# Altium project Gimbal_Rev2.PrjPcb (part 1 of 2)
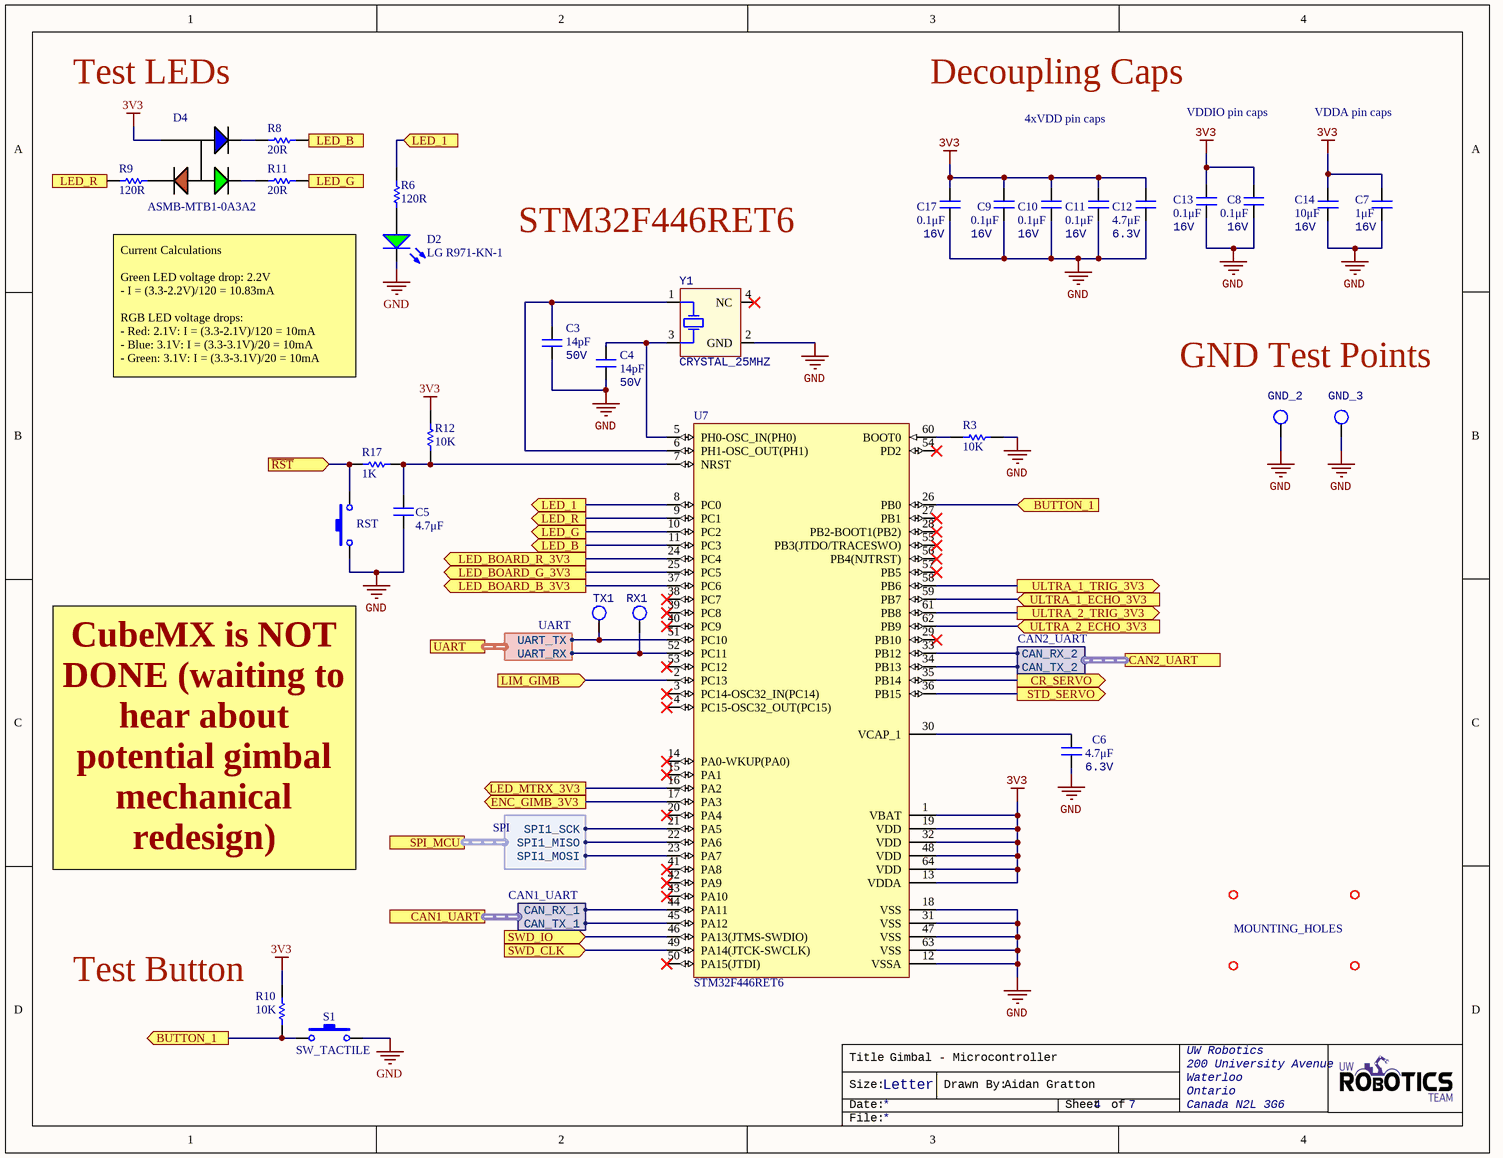
[diagram p0: MCU.SchDoc]
5 sheets, 110 parts. Net scope: flat (ports and power ports of the same name join across sheets).
Sheets:
  MCU.SchDoc
  Sensors.SchDoc
  Connectors.SchDoc
  CAN.SchDoc
  POWER.SchDoc

## Sheet MCU.SchDoc: Gimbal - Microcontroller
size Letter; DrawnBy: Aidan Gratton; Organization: UW Robotics; Address1: 200 University Avenue; Address2: Waterloo; Address3: Ontario; Address4: Canada N2L 3G6; SheetNumber: 4; SheetTotal: 7

### Parts
C3  value 14pF  Voltage Rating (DC): 50V  [CAPC0603(1608)55_N]  (hidden comment: CL10C140JB8NNNC)
C4  value 14pF  Voltage Rating (DC): 50V  [CAPC0603(1608)55_N]  (hidden comment: CL10C140JB8NNNC)
C5  value 4.7μF  [CAPC0603(1608)55_N]  (hidden comment: CAP_4.7uF_0603)
C6  value 4.7μF  Voltage Rating: 6.3V  [CAPC0603(1608)55_N]  (hidden comment: CAP_4.7uF_0603)
C7  value 1μF  Voltage Rating: 16V  [CAPC0603(1608)55_N]  (hidden comment: CAP_1uF_16V_0603)
C8  value 0.1μF  Voltage Rating: 16V  [CAPC0603(1608)55_N]  (hidden comment: CAP_0.1uF_16V_0603)
C9  value 0.1μF  Voltage Rating: 16V  [CAPC0603(1608)55_N]  (hidden comment: CAP_0.1uF_16V_0603)
C10  value 0.1μF  Voltage Rating: 16V  [CAPC0603(1608)55_N]  (hidden comment: CAP_0.1uF_16V_0603)
C11  value 0.1μF  Voltage Rating: 16V  [CAPC0603(1608)55_N]  (hidden comment: CAP_0.1uF_16V_0603)
C12  value 4.7μF  Voltage Rating: 6.3V  [CAPC0603(1608)55_N]  (hidden comment: CAP_4.7uF_0603)
C13  value 0.1μF  Voltage Rating: 16V  [CAPC0603(1608)55_N]  (hidden comment: CAP_0.1uF_16V_0603)
C14  value 10μF  Voltage Rating: 16V  [CAPC0603(1608)55_N]  (hidden comment: CAP_10nF_0603)
C17  value 0.1μF  Voltage Rating: 16V  [CAPC0603(1608)55_N]  (hidden comment: CAP_0.1uF_16V_0603)
D2  LG R971-KN-1  [LED_0805_LINE]
D4  Manufacturer Part Number 1: ASMB-MTB1-0A3A2  [LED_RGB]  (hidden comment: LED_RGB)
GND_2  TESTPOINT_LOOP  [TESTPOINT_LOOP]  (value not drawn)
GND_3  TESTPOINT_LOOP  [TESTPOINT_LOOP]  (value not drawn)
MH1  MOUNTING_HOLES  [MOUNTING_HOLE]
MH2  MOUNTING_HOLES  [MOUNTING_HOLE]  (value not drawn)
MH3  MOUNTING_HOLES  [MOUNTING_HOLE]  (value not drawn)
MH4  MOUNTING_HOLES  [MOUNTING_HOLE]  (value not drawn)
R3  value 10K  [RESC0603(1608)_N]  (hidden comment: RES_10K_0603)
R6  value 120R  [RESC0603(1608)_N]  (hidden comment: RES_120R_0603)
R8  value 20R  [RESC0603(1608)_N]  (hidden comment: RES_20R_0603)
R9  value 120R  [RESC0603(1608)_N]  (hidden comment: RES_120R_0603)
R10  value 10K  [RESC0603(1608)_N]  (hidden comment: RES_10K_0603)
R11  value 20R  [RESC0603(1608)_N]  (hidden comment: RES_20R_0603)
R12  value 10K  [RESC0603(1608)_N]  (hidden comment: RES_10K_0603)
R17  value 1K  [RESC0603(1608)_N]  (hidden comment: RES_1K_0603)
RST  SW_PWR  [PTS830GM140]  (value not drawn)
RX1  TESTPOINT_LOOP  [TESTPOINT_LOOP]  (value not drawn)
S1  SW_TACTILE  [B3U-1000P]
TX1  TESTPOINT_LOOP  [TESTPOINT_LOOP]  (value not drawn)
U7  STM32F446RET6  [STM-LQFP64_L]
Y1  CRYSTAL_25MHZ  [SOIC254P1016X440-4N]

### Ports
BUTTON_1 (in), BUTTON_1 (out), CAN1_UART (harness CAN1_UART), CAN2_UART (harness CAN2_UART), CR_SERVO (out), ENC_GIMB_3V3 (out), LED_1 (in), LED_1 (out), LED_B (in), LED_B (out), LED_BOARD_B_3V3 (out), LED_BOARD_G_3V3 (out), LED_BOARD_R_3V3 (out), LED_G (in), LED_G (out), LED_MTRX_3V3 (out), LED_R (in), LED_R (out), LIM_GIMB (in), SPI_MCU (harness SPI), STD_SERVO (out), SWD_CLK (in), SWD_IO (in), UART (harness UART), ULTRA_1_ECHO_3V3 (in), ULTRA_1_TRIG_3V3 (out), ULTRA_2_ECHO_3V3 (in), ULTRA_2_TRIG_3V3 (out), ~{RST} (in)

### Harnesses
UART: UART_RX, UART_TX
CAN1_UART: CAN_RX_1, CAN_TX_1
CAN2_UART: CAN_RX_2, CAN_TX_2
SPI: SPI1_SCK, SPI1_MISO, SPI1_MOSI

### Nets
3V3: C7.2 C8.2 C9.2 C10.2 C11.2 C12.2 C13.2 C14.2 C17.2 D4.4 R10.1 R12.2 U7.1(VBAT) U7.13(VDDA) U7.19(VDD) U7.32(VDD) U7.48(VDD) U7.64(VDD)
GND: C3.1 C4.1 C5.1 C6.1 C7.1 C8.1 C9.1 C10.1 C11.1 C12.1 C13.1 C14.1 C17.1 D2.2(K) GND_2.1 GND_3.1 R3.2 RST.1 S1.2 U7.12(VSSA) U7.18(VSS) U7.31(VSS) U7.47(VSS) U7.63(VSS) Y1.2(GND)
NetC3_2: C3.2 U7.6(PH1-OSC_OUT(PH1)) Y1.1(HOT)
NetC4_2: C4.2 U7.5(PH0-OSC_IN(PH0)) Y1.3(HOT)
NetC5_2: C5.2 R12.1 R17.2 U7.7(NRST)
NetC6_2: C6.2 U7.30(VCAP_1)
NetCR_SERVO_1: U7.35(PB14) ; port CR_SERVO
NetD2_1: D2.1(A) R6.2
NetD4_1: D4.1 R9.2
NetD4_2: D4.2 R11.1
NetD4_3: D4.3 R8.1
NetECHO1_1: U7.59(PB7) ; port ULTRA_1_ECHO_3V3
NetECHO2_1: U7.62(PB9) ; port ULTRA_2_ECHO_3V3
NetENC1_1: U7.17(PA3) ; port ENC_GIMB_3V3
NetJ1_2: TX1.1 U7.51(PC10) ; port UART.UART_TX
NetJ1_3: RX1.1 U7.52(PC11) ; port UART.UART_RX
NetJ1_6: U7.46(PA13(JTMS-SWDIO)) ; port SWD_IO
NetJ1_7: U7.49(PA14(JTCK-SWCLK)) ; port SWD_CLK
NetJ1_8: R17.1 RST.2 ; port ~{RST}
NetJ3_1: U7.36(PB15) ; port STD_SERVO
NetJ4_10: U7.2(PC13) ; port LIM_GIMB
NetR3_1: R3.1 U7.60(BOOT0)
NetR6_1: R6.1 U7.8(PC0) ; port LED_1
NetR8_2: R8.2 U7.11(PC3) ; port LED_B
NetR9_1: R9.1 U7.9(PC1) ; port LED_R
NetR10_2: R10.2 S1.1 U7.26(PB0) ; port BUTTON_1
NetR11_2: R11.2 U7.10(PC2) ; port LED_G
NetSPI_MISO_1: U7.22(PA6) ; port SPI_MCU.SPI1_MISO
NetSPI_MOSI_1: U7.23(PA7) ; port SPI_MCU.SPI1_MOSI
NetSPI_SCK_1: U7.21(PA5) ; port SPI_MCU.SPI1_SCK
NetU1_1: U7.45(PA12) ; port CAN1_UART.CAN_TX_1
NetU1_4: U7.44(PA11) ; port CAN1_UART.CAN_RX_1
NetU2_1: U7.34(PB13) ; port CAN2_UART.CAN_TX_2
NetU2_4: U7.33(PB12) ; port CAN2_UART.CAN_RX_2
NetU3_2: U7.58(PB6) ; port ULTRA_1_TRIG_3V3
NetU3_3: U7.61(PB8) ; port ULTRA_2_TRIG_3V3
NetU3_4: U7.16(PA2) ; port LED_MTRX_3V3
NetU5_2: U7.24(PC4) ; port LED_BOARD_R_3V3
NetU5_3: U7.25(PC5) ; port LED_BOARD_G_3V3
NetU5_4: U7.37(PC6) ; port LED_BOARD_B_3V3

Not connected (* = marked no-connect by the designer): U7 3(PC14-OSC32_IN(PC14))* 4(PC15-OSC32_OUT(PC15))* 14(PA0-WKUP(PA0))* 15(PA1)* 20(PA4)* 27(PB1)* 28(PB2-BOOT1(PB2))* 29(PB10)* 38(PC7)* 39(PC8)* 40(PC9)* 41(PA8)* 42(PA9)* 43(PA10)* 50(PA15(JTDI))* 53(PC12)* 54(PD2)* 55(PB3(JTDO/TRACESWO))* 56(PB4(NJTRST))* 57(PB5)*; Y1 4(NC)*

### Notes on the sheet
- Test LEDs
- Decoupling Caps
- 4xVDD pin caps
- VDDIO pin caps
- VDDA pin caps
- STM32F446RET6
- Current Calculations
  Green LED voltage drop: 2.2V
  - I = (3.3-2.2V)/120 = 10.83mA
  RGB LED voltage drops:
  - Red: 2.1V: I = (3.3-2.1V)/120 = 10mA
  - Blue: 3.1V: I = (3.3-3.1V)/20 = 10mA
  - Green: 3.1V: I = (3.3-3.1V)/20 = 10mA
- GND Test Points
- CubeMX is NOT DONE (waiting to hear about potential gimbal mechanical redesign)
- (near R10) Test Button
- Title
- Size:
- Date:
- Letter
- Drawn By:
- Sheet
- of
- File:

### Library data of the parts
C3 C4 = CL10C140JB8NNNC: Cap Ceramic 14pF 50V C0G 5% SMD 0603 125C Cardboard T/R; Manufacturer 1: Samsung; Voltage Rating: 50V; Supplier Part Number 1: 1276-2187-1-ND; Supplier 1: Digi-Key; Manufacturer Part Number 1: CL10C140JB8NNNC; Stock 1: 187088; Pricing 1: 1=0.10000, 10=0.06700, 100=0.02980, 500=0.02130, 1000=0.01673 (USD); RoHS: Yes; Mount: Surface Mount; Case/Package: 0603; Case Code (Metric): 1608; Case Code (Imperial): 0603; Min Operating Temperature: -55°C; Max Operating Temperature: 125°C; Tolerance: 5%; Package Quantity: 1; Packaging: Tape and Reel; Dielectric: C0G; Length: 1.6mm; Height: 0.8mm; Width: 0.031inch; Depth: 0.8mm; Thickness: 0.035inch; Radiation Hardening: No; ComponentLink1URL: https://datasheet.ciiva.com/25782/cl10c140jb8nnnc-25782947.pdf?src-supplier=Digi-Key; ComponentLink1Description: https://datasheet.ciiva.com/25782/cl10c140jb8nnnc-25782947.pdf?src-supplier=Digi-Key; Capacitance: 14pF
C5 C6 C12 = CAP_4.7uF_0603: CAP CER 4.7UF 6.3V X5R 0603; Manufacturer Part Number 1: CC0603KRX5R5BB475; Manufacturer 1: Yageo; Dimensions: 0.063" L x 0.031" W (1.60mm x 0.80mm); Package: 0603 (1608 Metric); Temperature Coefficient: X5R; Supplier Part Number 1: 311-1521-1-ND; Supplier 1: Digi-Key; Mount: Surface Mount; Case Code (Imperial): 0603; Case Code (Metric): 1608; Dielectric: X5R
  C5: Voltage Rating: 6.3V
C7 = CAP_1uF_16V_0603: CAP CER 1UF 16V Y5V 0603; Manufacturer Part Number: CC0603ZRY5V7BB105; Manufacturer 1: Yageo; Dimensions: 0.063" L x 0.031" W (1.60mm x 0.80mm); Package: 0603 (1608 Metric); Temperature Coefficient: Y5V; Supplier Part Number 1: 311-1372-1-ND; Supplier 1: Digi-Key; Mount: Surface Mount; Case Code (Imperial): 0603; Case Code (Metric): 1608; Manufacturer Part Number 1: CC0603ZRY5V7BB105; Dielectric: Y5V
C8-C11 C13 C17 = CAP_0.1uF_16V_0603: CAP CER 0.1UF 16V X7R 0603; Manufacturer Part Number 1: CC0603KRX7R7BB104; Manufacturer 1: Yageo; Dimensions: 0.063" L x 0.031" W (1.60mm x 0.80mm); Package: 0603 (1608 Metric); Temperature Coefficient: X7R; Supplier Part Number 1: 311-1088-1-ND; Supplier 1: Digi-Key; Mount: Surface Mount; Case Code (Imperial): 0603; Case Code (Metric): 1608; Dielectric: X7R
C14 = CAP_10nF_0603: CAP CER 10000PF 16V X7R 0603; Manufacturer Part Number 1: CC0603KRX7R7BB103; Manufacturer 1: Yageo; Dimensions: 0.063" L x 0.031" W (1.60mm x 0.80mm); Package: 0603 (1608 Metric); Temperature Coefficient: X7R; Supplier Part Number 1: 311-3369-1-ND; Supplier 1: Digi-Key; Mount: Surface Mount; Case Code (Imperial): 0603; Case Code (Metric): 1608; Dielectric: X7R
D2 = DIO_LED_G: LED GREEN DIFFUSED 0805 SMD; Manufacturer 1: OSRAM; Forward Voltage Drop: 2.2V; Package: 0805 (2012 Metric); Supplier Part Number 1: 475-1410-1-ND; Supplier 1: Digi-Key; Manufacturer Part Number 1: LG R971-KN-1; Mount: Surface Mount
D4 = LED_RGB: LED RGB DIFFUSED 4PLCC SMD; Manufacturer 1: Broadcom; Color: Blue,Green,Red; Lens Color: White; Viewing Angle: 115°; Lens Style: Round; Luminous Intensity: 350mcd; Dominant Wavelength: 470nm; Forward Voltage: 3.1V; Test Current: 20mA; Supplier 1: Digi-Key; Stock 1: 142531; Pricing 1: 1=0.60000, 10=0.47100, 100=0.30210, 500=0.25980, 1000=0.20059 (USD); RoHS: Yes; Mount: Surface Mount; Case/Package: PLCC; Number of Pins: 4; Packaging: Cut Tape; Lens Transparency: Diffused; Length: 3.2mm; Height: 1.9mm; Width: 2.8mm; REACH SVHC: No SVHC; ComponentLink1URL: http://www.farnell.com/datasheets/2111106.pdf?src-supplier=Farnell; ComponentLink1Description: http://www.farnell.com/datasheets/2111106.pdf?src-supplier=Farnell; ComponentLink2URL: https://docs.broadcom.com/docs/AV02-4194EN?src-supplier=Digi-Key; ComponentLink2Description: https://docs.broadcom.com/docs/AV02-4194EN?src-supplier=Digi-Key; ComponentLink3URL: http://www.farnell.com/datasheets/1801564.pdf?src-supplier=Element14; ComponentLink3Description: http://www.farnell.com/datasheets/1801564.pdf?src-supplier=Element14; ComponentLink4URL: http://www.farnell.com/datasheets/2111106.pdf?src-supplier=Newark; ComponentLink4Description: http://www.farnell.com/datasheets/2111106.pdf?src-supplier=Newark; Supplier Part Number 1: 516-3280-1-ND
GND_2 GND_3 RX1 TX1 = TESTPOINT_LOOP: Loop testpoint through-hole pad; Manufacturer Part Number 1: 5002; Manufacturer 1: Keystone Electronics; Supplier Part Number 1: 36-5002-ND; Supplier 1: Digi-Key; Mount: Through Hole
MH1-MH4 = MOUNTING_HOLES: 6cm x 6cm
R3 R10 R12 = RES_10K_0603: RES SMD 10K OHM 5% 1/10W 0603; Manufacturer: Yageo; MPN: RC0603JR-0710KL; Package: 0603 (1608 Metric); Dimensions: 0.063" L x 0.031" W (1.60mm x 0.80mm); Tolerance: 5%; Supplier Part Number 1: 311-10KGRCT-ND; Supplier 1: Digi-Key
R6 R9 = RES_120R_0603: RES SMD 120 OHM 5% 1/10W 0603; Manufacturer: Yageo; MPN: RC0603JR-07120RL; Package: 0603 (1608 Metric); Dimensions: 0.063" L x 0.031" W (1.60mm x 0.80mm); Tolerance: 5%; Supplier Part Number 1: 311-120GRCT-ND; Supplier 1: Digi-Key
R8 R11 = RES_20R_0603: RES SMD 20 OHM 5% 1/10W 0603; Manufacturer: Yageo; MPN: RC0603JR-0720RL; Package: 0603 (1608 Metric); Dimensions: 0.063" L x 0.031" W (1.60mm x 0.80mm); Tolerance: 5%; Supplier Part Number 1: 311-20GRCT-ND; Supplier 1: Digi-Key
R17 = RES_1K_0603: RES SMD 1K OHM 5% 1/10W 0603; Manufacturer 1: Yageo; Manufacturer Part Number 1: RC0603JR-071KL; Dimensions: 0.063" L x 0.031" W (1.60mm x 0.80mm); Tolerance: 5%; Package: 0603 (1608 Metric); Supplier Part Number 1: 311-1.0KGRCT-ND; Supplier 1: Digi-Key; Mount: Surface Mount
RST = SW_PWR: Power Switch (Red); pin to pad: 2>4; Manufacturer Part Number 1: PTS830GM140 SMTR LFS; Manufacturer 1: C&K; ComponentLink1Description: Datasheet; ComponentLink1URL: https://www.ckswitches.com/media/1478/pts830.pdf; Supplier Part Number 1: CKN10587CT-ND; Supplier 1: Digi-Key; Mount: Surface Mount
S1 = SW_TACTILE: Tactile Switch (Grey); Manufacturer 1: Omron Electronics Inc-EMC Div; Supplier Part Number 1: SW1020CT-ND; Supplier 1: Digi-Key; Manufacturer Part Number 1: B3U-1000P; Mount: Surface Mount
U7 = MCU_STM32F446RET6: ARM Cortex-M4 32-bit MCU+FPU, 512 KB Flash, 128 KB Internal RAM, 50 I/Os, 64-Pin LQFP, -40 to 85 degC, Tray; I/Os (High Current): 50; Supply Voltage(Vcc) min (V): 1.7; Operating Frequency(F) (Processor speed) (MHz): 180; D/A Converter: 2; Internal RAM Size (kB): 128; FLASH Size (Prog) (kB): 512; Core: ARM Cortex-M4; ComponentLink1Description: Manufacturer URL; Package Reference: 64-Pin Low-profile Quad Flat Package, Body 10 x 10 mm, Pitch 0.5 mm; ComponentLink2URL: http://www.st.com/st-web-ui/static/active/en/resource/technical/document/datasheet/DM00141306.pdf; Packing: Tray; DatasheetVersion: Rev. 6; ComponentLink1URL: http://www.st.com/; ComponentLink2Description: Datasheet; Package Description: LQFP64; Mounting Technology: Surface Mount; Supplier Part Number 1: 497-15376-ND; Supplier 1: Digi-Key
Y1 = CRYSTAL_25MHZ: CRYSTAL 25.0000MHZ 12PF SMD; Manufacturer 1: Kyocera AVX; Manufacturer Part Number 1: CX2520DB25000H0FLJC1; Frequency: 25MHz; ESR (Equivalent Series Resistance): 80R; Frequency Stability: 15ppm; Frequency Tolerance: 10ppm; ComponentLink1Description: https://media.digikey.com/pdf/Data%20Sheets/AVX%20PDFs/CX2520DB_USY1M-H1-16429-00_Spec.pdf?src-supplier=Digi-Key; ComponentLink1URL: https://media.digikey.com/pdf/Data%20Sheets/AVX%20PDFs/CX2520DB_USY1M-H1-16429-00_Spec.pdf?src-supplier=Digi-Key; Supplier 1: Digi-Key; Supplier Part Number 1: 1253-1724-1-ND; Stock 1: 11741; Pricing 1: 1=0.72000, 10=0.63300, 50=0.59120, 100=0.52250, 500=0.49500, 1000=0.41250 (USD); RoHS: Yes; Mount: Surface Mount; Case/Package: SMD/SMT; Min Operating Temperature: -30°C; Max Operating Temperature: 85°C; Packaging: Tape and Reel; Load Capacitance: 12pF; Length: 0.098inch; Height: 0.022inch; Width: 0.079inch; Ratings: AEC-Q200

## Sheet Sensors.SchDoc: Gimbal - Sensors
size Letter; DrawnBy: Aidan Gratton; Organization: UW Robotics; Address1: 200 University Avenue; Address2: Waterloo; Address3: Ontario; Address4: Canada N2L 3G6; SheetNumber: 5; SheetTotal: 7
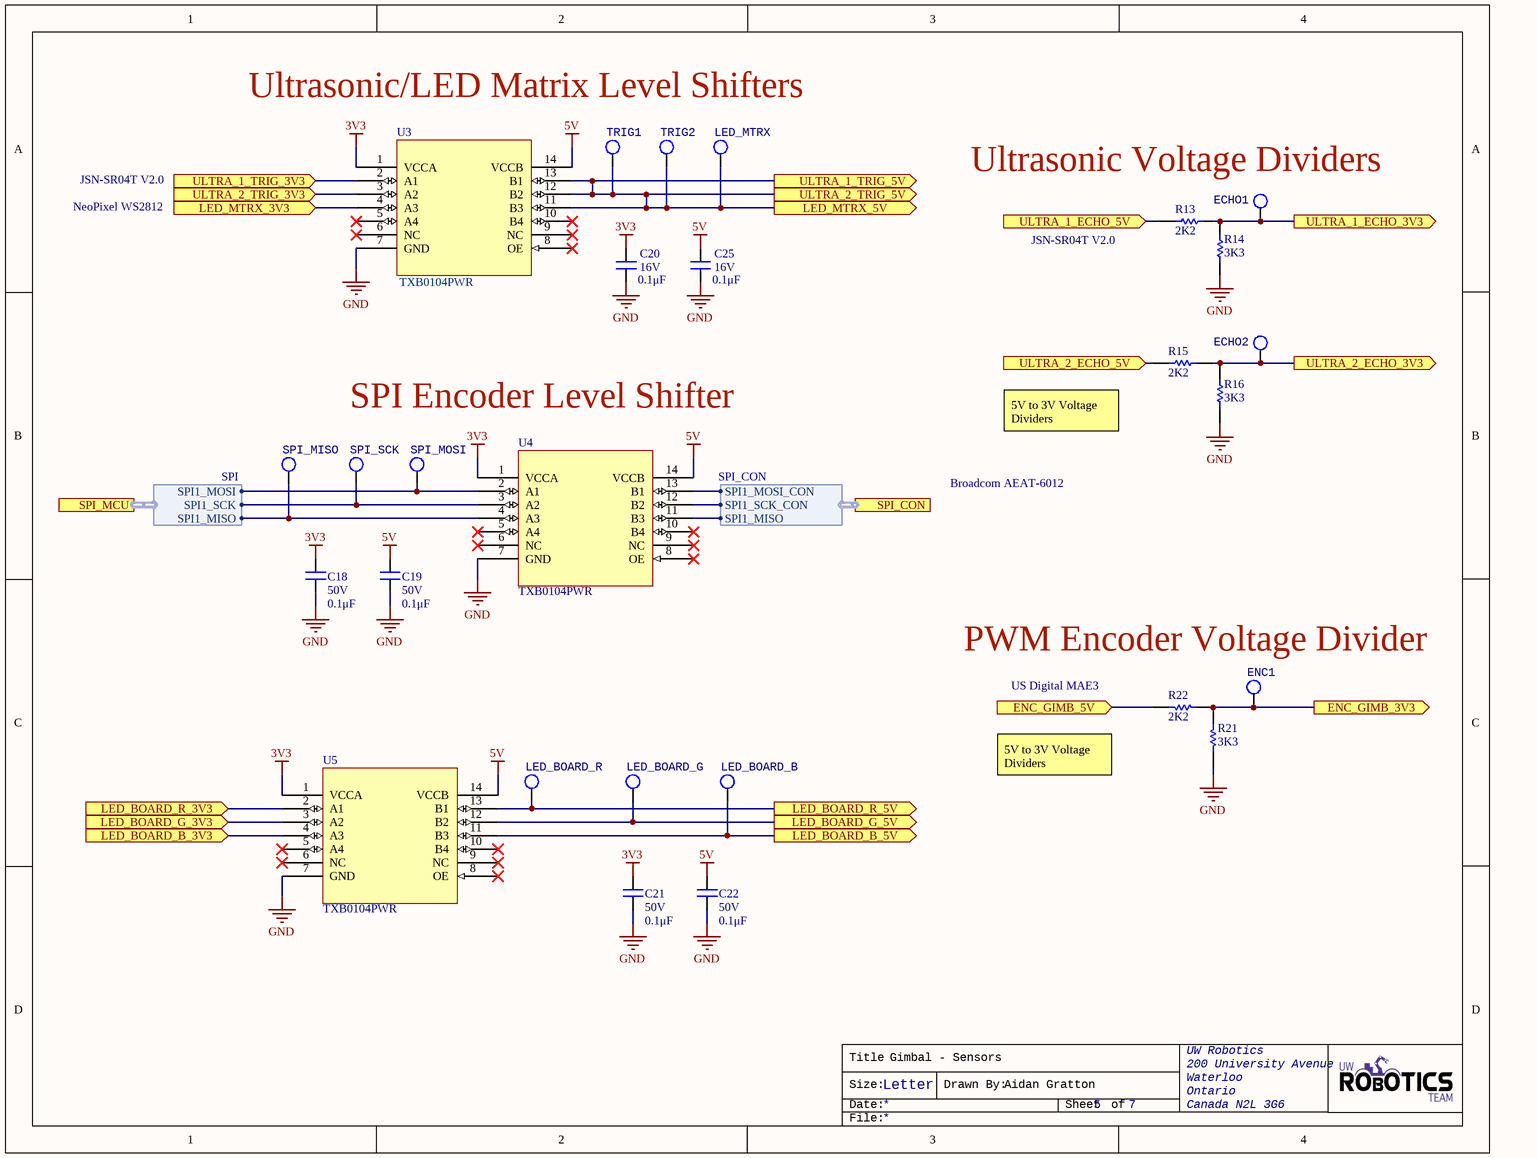
[diagram p1: Sensors.SchDoc]

### Parts
C18  value 0.1μF  Voltage Rating: 50V  [CAPC0603(1608)55_N]  (hidden comment: CAP_0.1uF_50V_0603)
C19  value 0.1μF  Voltage Rating: 50V  [CAPC0603(1608)55_N]  (hidden comment: CAP_0.1uF_50V_0603)
C20  value 0.1μF  Voltage Rating: 16V  [CAPC0603(1608)55_N]  (hidden comment: CAP_0.1uF_16V_0603)
C21  value 0.1μF  Voltage Rating: 50V  [CAPC0603(1608)55_N]  (hidden comment: CAP_0.1uF_50V_0603)
C22  value 0.1μF  Voltage Rating: 50V  [CAPC0603(1608)55_N]  (hidden comment: CAP_0.1uF_50V_0603)
C25  value 0.1μF  Voltage Rating: 16V  [CAPC0603(1608)55_N]  (hidden comment: CAP_0.1uF_16V_0603)
ECHO1  TESTPOINT_LOOP  [TESTPOINT_LOOP]  (value not drawn)
ECHO2  TESTPOINT_LOOP  [TESTPOINT_LOOP]  (value not drawn)
ENC1  TESTPOINT_LOOP  [TESTPOINT_LOOP]  (value not drawn)
LED_BOARD_B  TESTPOINT_LOOP  [TESTPOINT_LOOP]  (value not drawn)
LED_BOARD_G  TESTPOINT_LOOP  [TESTPOINT_LOOP]  (value not drawn)
LED_BOARD_R  TESTPOINT_LOOP  [TESTPOINT_LOOP]  (value not drawn)
LED_MTRX  TESTPOINT_LOOP  [TESTPOINT_LOOP]  (value not drawn)
R13  value 2K2  [RESC0603(1608)_N]  (hidden comment: RES_2K2_0603)
R14  value 3K3  [RESC0603(1608)_N]  (hidden comment: RES_3K3_0603)
R15  value 2K2  [RESC0603(1608)_N]  (hidden comment: RES_2K2_0603)
R16  value 3K3  [RESC0603(1608)_N]  (hidden comment: RES_3K3_0603)
R21  value 3K3  [RESC0603(1608)_N]  (hidden comment: RES_3K3_0603)
R22  value 2K2  [RESC0603(1608)_N]  (hidden comment: RES_2K2_0603)
SPI_MISO  TESTPOINT_LOOP  [TESTPOINT_LOOP]  (value not drawn)
SPI_MOSI  TESTPOINT_LOOP  [TESTPOINT_LOOP]  (value not drawn)
SPI_SCK  TESTPOINT_LOOP  [TESTPOINT_LOOP]  (value not drawn)
TRIG1  TESTPOINT_LOOP  [TESTPOINT_LOOP]  (value not drawn)
TRIG2  TESTPOINT_LOOP  [TESTPOINT_LOOP]  (value not drawn)
U3  TXB0104PWR  [PW14]
U4  TXB0104PWR  [PW14]
U5  TXB0104PWR  [PW14]

### Ports
ENC_GIMB_3V3 (out), ENC_GIMB_5V (in), LED_BOARD_B_3V3 (in), LED_BOARD_B_5V (out), LED_BOARD_G_3V3 (in), LED_BOARD_G_5V (out), LED_BOARD_R_3V3 (in), LED_BOARD_R_5V (out), LED_MTRX_3V3 (in), LED_MTRX_5V (out), SPI_CON (harness SPI_CON), SPI_MCU (harness SPI), ULTRA_1_ECHO_3V3 (out), ULTRA_1_ECHO_5V (in), ULTRA_1_TRIG_3V3 (in), ULTRA_1_TRIG_5V (out), ULTRA_2_ECHO_3V3 (out), ULTRA_2_ECHO_5V (in), ULTRA_2_TRIG_3V3 (in), ULTRA_2_TRIG_5V (out)

### Harnesses
SPI: SPI1_MISO, SPI1_MOSI, SPI1_SCK
SPI_CON: SPI1_MISO, SPI1_MOSI_CON, SPI1_SCK_CON

### Nets
3V3: C18.2 C20.2 C21.2 U3.1(VCCA) U4.1(VCCA) U5.1(VCCA)
5V: C19.2 C22.2 C25.2 U3.14(VCCB) U4.14(VCCB) U5.14(VCCB)
GND: C18.1 C19.1 C20.1 C21.1 C22.1 C25.1 R14.1 R16.2 R21.2 U3.7(GND) U4.7(GND) U5.7(GND)
NetECHO1_1: ECHO1.1 R13.1 R14.2 ; port ULTRA_1_ECHO_3V3
NetECHO2_1: ECHO2.1 R15.1 R16.1 ; port ULTRA_2_ECHO_3V3
NetENC1_1: ENC1.1 R21.1 R22.1 ; port ENC_GIMB_3V3
NetJ4_3: R13.2 ; port ULTRA_1_ECHO_5V
NetJ4_5: LED_MTRX.1 TRIG1.1 TRIG2.1 U3.11(B3) U3.12(B2) U3.13(B1) ; port ULTRA_1_TRIG_5V, port ULTRA_2_TRIG_5V, port LED_MTRX_5V
NetJ4_9: R15.2 ; port ULTRA_2_ECHO_5V
NetJ4_15: U4.13(B1) ; port SPI_CON.SPI1_MOSI_CON
NetJ4_17: U4.12(B2) ; port SPI_CON.SPI1_SCK_CON
NetJ4_19: U4.11(B3) ; port SPI_CON.SPI1_MISO
NetJ4_23: R22.2 ; port ENC_GIMB_5V
NetJ5_1: LED_BOARD_R.1 U5.13(B1) ; port LED_BOARD_R_5V
NetJ5_2: LED_BOARD_G.1 U5.12(B2) ; port LED_BOARD_G_5V
NetJ5_3: LED_BOARD_B.1 U5.11(B3) ; port LED_BOARD_B_5V
NetSPI_MISO_1: SPI_MISO.1 U4.4(A3) ; port SPI_MCU.SPI1_MISO
NetSPI_MOSI_1: SPI_MOSI.1 U4.2(A1) ; port SPI_MCU.SPI1_MOSI
NetSPI_SCK_1: SPI_SCK.1 U4.3(A2) ; port SPI_MCU.SPI1_SCK
NetU3_2: U3.2(A1) ; port ULTRA_1_TRIG_3V3
NetU3_3: U3.3(A2) ; port ULTRA_2_TRIG_3V3
NetU3_4: U3.4(A3) ; port LED_MTRX_3V3
NetU5_2: U5.2(A1) ; port LED_BOARD_R_3V3
NetU5_3: U5.3(A2) ; port LED_BOARD_G_3V3
NetU5_4: U5.4(A3) ; port LED_BOARD_B_3V3

Not connected (* = marked no-connect by the designer): U3 5(A4)* 6(NC)* 8(OE)* 9(NC)* 10(B4)*; U4 5(A4)* 6(NC)* 8(OE)* 9(NC)* 10(B4)*; U5 5(A4)* 6(NC)* 8(OE)* 9(NC)* 10(B4)*

### Notes on the sheet
- Ultrasonic/LED Matrix Level Shifters
- NeoPixel WS2812
- JSN-SR04T V2.0
- Ultrasonic Voltage Dividers
- SPI Encoder Level Shifter
- 5V to 3V Voltage Dividers
- Broadcom AEAT-6012
- PWM Encoder Voltage Divider
- US Digital MAE3
- Title
- Size:
- Date:
- Letter
- Drawn By:
- Sheet
- of
- File:

### Library data of the parts
C18 C19 C21 C22 = CAP_0.1uF_50V_0603: CAP CER 0.1UF 50V X7R 0603; Manufacturer Part Number 1: CC0603KRX7R9BB104; Manufacturer 1: Yageo; Dimensions: 0.063" L x 0.031" W (1.60mm x 0.80mm); Package: 0603 (1608 Metric); Temperature Coefficient: X7R; Supplier Part Number 1: 311-1344-1-ND; Supplier 1: Digi-Key; Mount: Surface Mount; Case Code (Imperial): 0603; Case Code (Metric): 1608; Dielectric: X7R
C20 C25 = CAP_0.1uF_16V_0603: as C8 on sheet MCU; Dimensions: 0.063" L x 0.031" W (1.60mm x 0.80mm); Package: 0603 (1608 Metric); Temperature Coefficient: X7R; Supplier Part Number 1: 311-1088-1-ND; Supplier 1: Digi-Key; Mount: Surface Mount; Case Code (Imperial): 0603; Case Code (Metric): 1608; Dielectric: X7R
ECHO1 ECHO2 ENC1 LED_BOARD_B LED_BOARD_G LED_BOARD_R SPI_MISO SPI_MOSI SPI_SCK TRIG1 TRIG2 = TESTPOINT_LOOP: as GND_2 on sheet MCU; Supplier Part Number 1: 36-5002-ND; Supplier 1: Digi-Key; Mount: Through Hole
LED_MTRX = TESTPOINT_LOOP: Loop testpoint through-hole pad; Manufacturer 1: Keystone Electronics; Manufacturer Part Number 1: 5002; Supplier Part Number 1: 36-5002-ND; Supplier 1: Digi-Key; Mount: Through Hole
R13 R15 R22 = RES_2K2_0603: RES SMD 2.2K OHM 1% 1/10W 0603; Manufacturer: Yageo; MPN: RC0603FR-072K2L; Dimensions: 0.063" L x 0.031" W (1.60mm x 0.80mm); Package: 0603 (1608 Metric); Tolerance: 1%; Supplier Part Number 1: 311-2.20KHRCT-ND; Supplier 1: Digi-Key
R14 = RES_3K3_0603: RES SMD 3.3K OHM 5% 1/10W 0603; Manufacturer 1: Yageo; Manufacturer Part Number 1: RC0603JR-073K3L; Dimensions: 0.063" L x 0.031" W (1.60mm x 0.80mm); Package: 0603 (1608 Metric); Tolerance: 5%; Digikey Part Number: 311-3.3KGRCT-ND; Supplier 1: Digi-Key; Supplier Part Number 1: 311-3.3KGRCT-ND; Mount: Surface Mount
R16 R21 = RES_3K3_0603: RES SMD 3.3K OHM 5% 1/10W 0603; Manufacturer: Yageo; MPN: RC0603JR-073K3L; Dimensions: 0.063" L x 0.031" W (1.60mm x 0.80mm); Package: 0603 (1608 Metric); Tolerance: 5%; Digikey Part Number: 311-3.3KGRCT-ND; Supplier 1: Digi-Key; Supplier Part Number 1: 311-3.3KGRCT-ND
U3-U5 = IC_4CH_LVL_SHIFTER: 4-Bit Bidirectional Voltage-Level Translator with Auto Direction Sensing / VCCA < VCCB, see datasheet; Manufacturer 1: Texas Instruments; PACKAGE_DESIGNATOR: PW; PIN_COUNT: 14; FAMILY_NAME: AUTO DIRECTION SENSING DUAL SUPPLY TRANSLATOR; INDUSTRY_STD_PKG_TYPE: TSSOP; VCCB MAX: 5.5 V; VCCA MAX: 3.6 V; GENERIC_PART_NUMBER: TXB0104; Datasheet_URL: http://www.ti.com/lit/gpn/TXB0104; Supplier 1: Digi-Key; Supplier Part Number 1: 296-21929-1-ND; Manufacturer Part Number 1: TXB0104PWR

## Sheet Connectors.SchDoc: Gimbal - Connectors
size Letter; DrawnBy: Aidan Gratton; Organization: UW Robotics; Address1: 200 University Avenue; Address2: Waterloo; Address3: Ontario; Address4: Canada N2L 3G6; SheetNumber: 3; SheetTotal: 7
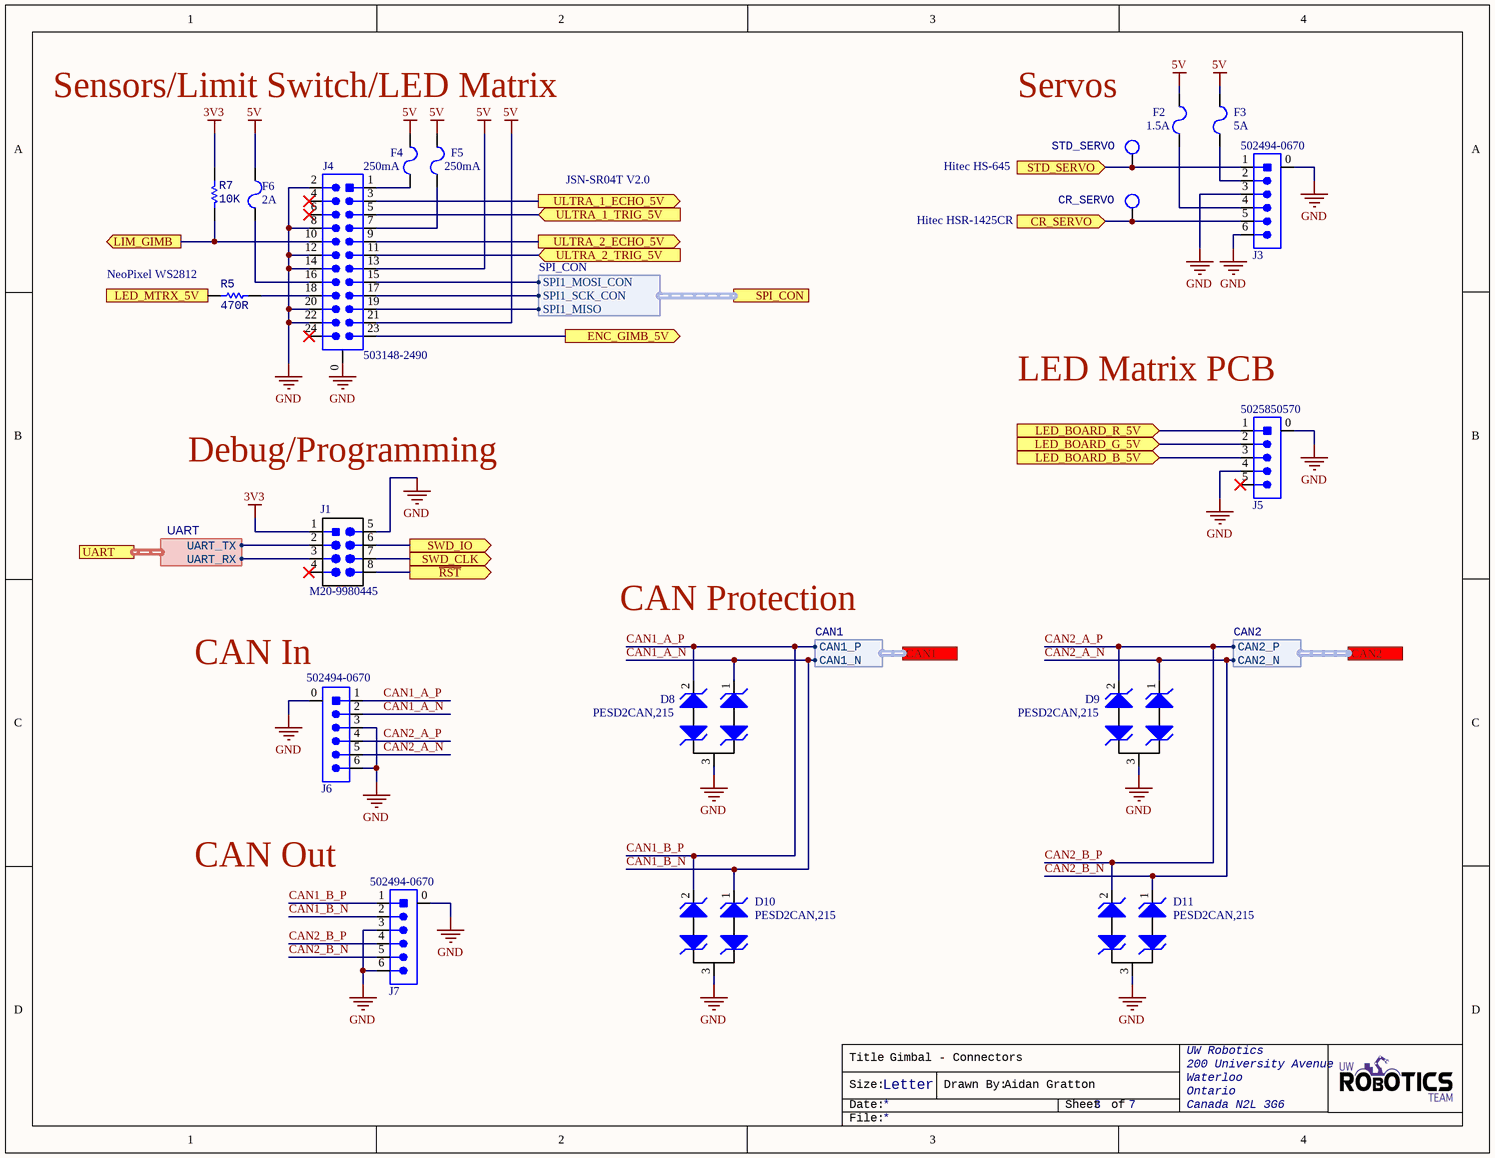
[diagram p2: Connectors.SchDoc]

### Parts
CR_SERVO  TESTPOINT_LOOP  [TESTPOINT_LOOP]  (value not drawn)
D8  Manufacturer Part Number 1: PESD2CAN,215  [TVS_DIODE_CAN]  (hidden comment: TVS_DIODE_CAN)
D9  Manufacturer Part Number 1: PESD2CAN,215  [TVS_DIODE_CAN]  (hidden comment: TVS_DIODE_CAN)
D10  Manufacturer Part Number 1: PESD2CAN,215  [TVS_DIODE_CAN]  (hidden comment: TVS_DIODE_CAN)
D11  Manufacturer Part Number 1: PESD2CAN,215  [TVS_DIODE_CAN]  (hidden comment: TVS_DIODE_CAN)
F2  Current Rating: 1.5A  [FUSE_1206]  (hidden comment: FUSE_1.5A_1206)
F3  Current Rating: 5A  [FUSE_1206]  (hidden comment: FUSE_5A_1206)
F4  Current Rating: 250mA  [FUSE_1206]  (hidden comment: FUSE_250mA_1206)
F5  Current Rating: 250mA  [FUSE_1206]  (hidden comment: FUSE_250mA_1206)
F6  Current Rating: 2A  [FUSE_1206]  (hidden comment: FUSE_2A_1206)
J1  Manufacturer Part Number 1: M20-9980445  [HEADER_2X4]  (hidden comment: HEADER 4X2)
J3  Manufacturer Part Number 1: 502494-0670  [MOLEX-5024940670]  (hidden comment: CON_6M_SM_RA)
J4  Manufacturer Part Number 1: 503148-2490  [MOLEX-5031482490]  (hidden comment: CON_12x2M_SM_RA)
J5  Manufacturer Part Number 1: 5025850570  [MOLEX-5025850570]  (hidden comment: CON_5M_SM_RA)
J6  Manufacturer Part Number 1: 502494-0670  [MOLEX-5024940670]  (hidden comment: CON_6M_SM_RA)
J7  Manufacturer Part Number 1: 502494-0670  [MOLEX-5024940670]  (hidden comment: CON_6M_SM_RA)
R5  value 470R  [RESC0603(1608)_N]  (hidden comment: 470R 1%)
R7  value 10K  [RESC0603(1608)_N]  (hidden comment: RES_10K_0603)
STD_SERVO  TESTPOINT_LOOP  [TESTPOINT_LOOP]  (value not drawn)

### Ports
CAN1 (harness CAN1), CAN2 (harness CAN2), CR_SERVO (in), ENC_GIMB_5V (out), LED_BOARD_B_5V (in), LED_BOARD_G_5V (in), LED_BOARD_R_5V (in), LED_MTRX_5V (in), LIM_GIMB (out), SPI_CON (harness SPI_CON), STD_SERVO (in), SWD_CLK (out), SWD_IO (out), UART (harness UART), ULTRA_1_ECHO_5V (out), ULTRA_1_TRIG_5V (in), ULTRA_2_ECHO_5V (out), ULTRA_2_TRIG_5V (in), ~{RST} (out)

### Harnesses
UART: UART_RX, UART_TX
CAN2: CAN2_P, CAN2_N
CAN1: CAN1_P, CAN1_N
SPI_CON: SPI1_MISO, SPI1_MOSI_CON, SPI1_SCK_CON

### Nets
3V3: J1.1(VCC) R7.2
5V: F2.2 F3.2 F4.1 F5.2 F6.2 J4.13 J4.21
GND: D8.3 D9.3 D10.3 D11.3 J1.5(GND) J3.0 J3.3 J3.6 J4.0 J4.2 J4.8 J4.12 J4.14 J4.20 J4.22 J5.0 J5.4 J6.0 J6.3 J6.6 J7.0 J7.3 J7.6
CAN1_A_N: D8.1 D10.1 J6.2 J7.2 ; port CAN1.CAN1_N  [also labelled CAN1_B_N]
CAN1_A_P: D8.2 D10.2 J6.1 J7.1 ; port CAN1.CAN1_P  [also labelled CAN1_B_P]
CAN2_A_N: D9.1 D11.1 J6.5 J7.5 ; port CAN2.CAN2_N  [also labelled CAN2_B_N]
CAN2_A_P: D9.2 D11.2 J6.4 J7.4 ; port CAN2.CAN2_P  [also labelled CAN2_B_P]
NetCR_SERVO_1: CR_SERVO.1 J3.5 ; port CR_SERVO
NetF2_1: F2.1 J3.4
NetF3_1: F3.1 J3.2
NetF4_2: F4.2 J4.1
NetF5_1: F5.1 J4.7
NetF6_1: F6.1 J4.16
NetJ1_2: J1.2 ; port UART.UART_TX
NetJ1_3: J1.3 ; port UART.UART_RX
NetJ1_6: J1.6 ; port SWD_IO
NetJ1_7: J1.7 ; port SWD_CLK
NetJ1_8: J1.8 ; port ~{RST}
NetJ3_1: J3.1 STD_SERVO.1 ; port STD_SERVO
NetJ4_3: J4.3 ; port ULTRA_1_ECHO_5V
NetJ4_5: J4.5 J4.11 R5.1 ; port LED_MTRX_5V, port ULTRA_1_TRIG_5V, port ULTRA_2_TRIG_5V
NetJ4_9: J4.9 ; port ULTRA_2_ECHO_5V
NetJ4_10: J4.10 R7.1 ; port LIM_GIMB
NetJ4_15: J4.15 ; port SPI_CON.SPI1_MOSI_CON
NetJ4_17: J4.17 ; port SPI_CON.SPI1_SCK_CON
NetJ4_18: J4.18 R5.2
NetJ4_19: J4.19 ; port SPI_CON.SPI1_MISO
NetJ4_23: J4.23 ; port ENC_GIMB_5V
NetJ5_1: J5.1 ; port LED_BOARD_R_5V
NetJ5_2: J5.2 ; port LED_BOARD_G_5V
NetJ5_3: J5.3 ; port LED_BOARD_B_5V

Not connected (* = marked no-connect by the designer): J1 4*; J4 4* 6* 24*; J5 5*

### Notes on the sheet
- Sensors/Limit Switch/LED Matrix
- Servos
- JSN-SR04T V2.0
- Hitec HSR-1425CR
- Hitec HS-645
- (near R5) NeoPixel WS2812
- (near J5) LED Matrix PCB
- Debug/Programming
- CAN Protection
- (near J6) CAN In
- CAN Out
- Title
- Size:
- Date:
- Letter
- Drawn By:
- Sheet
- of
- File:

### Library data of the parts
CR_SERVO STD_SERVO = TESTPOINT_LOOP: as GND_2 on sheet MCU; Supplier Part Number 1: 36-5002-ND; Supplier 1: Digi-Key; Mount: Through Hole
D8-D11 = TVS_DIODE_CAN: TVS DIODE 24V 41V SOT323-3; Manufacturer 1: Nexperia USA Inc.; Package: SC-70, SOT-323; ComponentLink1Description: Datasheet; ComponentLink1URL: https://assets.nexperia.com/documents/data-sheet/PESD1CAN-U.pdf; Supplier Part Number 1: 1727-3891-1-ND; Supplier 1: Digi-Key; Mount: Surface Mount
F2 = FUSE_1.5A_1206: FUSE SMD 1.5A 63V; Manufacturer 1: Littelfuse; Manufacturer Part Number 1: 046601.5NR; Fuse Type: Board Mount (Cartridge Style Excluded); DC Cold Resistance: 31mR; Power Dissipation: 157.5mW; Approvals: UL,CSA; Supplier 1: Digi-Key; Stock 1: 8989; Pricing 1: 1=0.84000, 5=0.81200, 10=0.78700, 50=0.66180, 100=0.54930, 250=0.49940, 500=0.42450, 1000=0.37455 (USD); RoHS: Yes; Mount: Surface Mount; Case/Package: 1206; Case Code (Imperial): 1206; Case Code (Metric): 3216; Housing Material: Ceramic; Min Operating Temperature: -55°C; Max Operating Temperature: 90°C; Package Quantity: 5000; Voltage Rating (AC): 63V; Voltage Rating (DC): 63V; Packaging: Cut Tape; Current: 1.5A; Length: 3.18mm; Height: 0.023inch; Width: 0.06inch; Depth: 1.52mm; ComponentLink1URL: https://datasheet.ciiva.com/7444/littelfuse-fuse-466-7444359.pdf?src-supplier=Digi-Key; ComponentLink1Description: https://datasheet.ciiva.com/7444/littelfuse-fuse-466-7444359.pdf?src-supplier=Digi-Key; ComponentLink2URL: https://datasheet.ciiva.com/7444/littelfuse-fuse-466-7444363.pdf?src-supplier=Digi-Key; ComponentLink2Description: https://datasheet.ciiva.com/7444/littelfuse-fuse-466-7444363.pdf?src-supplier=Digi-Key; ComponentLink3URL: https://datasheet.ciiva.com/7444/littelfuse-fuse-466-7444350.pdf?src-supplier=Digi-Key; ComponentLink3Description: https://datasheet.ciiva.com/7444/littelfuse-fuse-466-7444350.pdf?src-supplier=Digi-Key; Supplier Part Number 1: F1462CT-ND
F3 = FUSE_5A_1206: FUSE SMD 5A 63V; Manufacturer 1: Littelfuse; Manufacturer Part Number 1: 0466005.NRHF; Voltage Rating (AC): 32V; Fuse Type: Board Mount (Cartridge Style Excluded); DC Cold Resistance: 31mR; Power Dissipation: 157.5mW; Approvals: UL,CSA; Supplier 1: Digi-Key; Stock 1: 8989; Pricing 1: 1=0.84000, 5=0.81200, 10=0.78700, 50=0.66180, 100=0.54930, 250=0.49940, 500=0.42450, 1000=0.37455 (USD); RoHS: Yes; Mount: Surface Mount; Case/Package: 1206; Case Code (Imperial): 1206; Case Code (Metric): 3216; Housing Material: Ceramic; Min Operating Temperature: -55°C; Max Operating Temperature: 90°C; Package Quantity: 5000; Voltage Rating (DC): 32V; Packaging: Cut Tape; Current: 5A; Length: 3.18mm; Height: 0.023inch; Width: 0.06inch; Depth: 1.52mm; ComponentLink1URL: https://datasheet.ciiva.com/7444/littelfuse-fuse-466-7444359.pdf?src-supplier=Digi-Key; ComponentLink1Description: https://datasheet.ciiva.com/7444/littelfuse-fuse-466-7444359.pdf?src-supplier=Digi-Key; ComponentLink2URL: https://datasheet.ciiva.com/7444/littelfuse-fuse-466-7444363.pdf?src-supplier=Digi-Key; ComponentLink2Description: https://datasheet.ciiva.com/7444/littelfuse-fuse-466-7444363.pdf?src-supplier=Digi-Key; ComponentLink3URL: https://datasheet.ciiva.com/7444/littelfuse-fuse-466-7444350.pdf?src-supplier=Digi-Key; ComponentLink3Description: https://datasheet.ciiva.com/7444/littelfuse-fuse-466-7444350.pdf?src-supplier=Digi-Key; Supplier Part Number 1: F6019CT-ND
F4 F5 = FUSE_250mA_1206: FUSE SMD 250mA 125V; Manufacturer 1: Littelfuse; Manufacturer Part Number 1: 0466.250NR; Fuse Type: Board Mount (Cartridge Style Excluded); DC Cold Resistance: 31mR; Power Dissipation: 157.5mW; Approvals: UL,CSA; Fuse Current: 15A; Resistance: 5.05mR; Working Voltage: 250V; Supplier 1: Digi-Key; Stock 1: 8989; Pricing 1: 1=0.84000, 5=0.81200, 10=0.78700, 50=0.66180, 100=0.54930, 250=0.49940, 500=0.42450, 1000=0.37455 (USD); RoHS: Yes; Mount: Surface Mount; Case/Package: 1206; Case Code (Imperial): 1206; Case Code (Metric): 3216; Housing Material: Ceramic; Min Operating Temperature: -55°C; Max Operating Temperature: 90°C; Package Quantity: 5000; Voltage Rating (AC): 125V; Voltage Rating (DC): 125V; Packaging: Cut Tape; Current: 250mA; Length: 3.18mm; Height: 0.023inch; Width: 0.06inch; Depth: 1.52mm; ComponentLink1URL: https://datasheet.ciiva.com/7444/littelfuse-fuse-466-7444359.pdf?src-supplier=Digi-Key; ComponentLink1Description: https://datasheet.ciiva.com/7444/littelfuse-fuse-466-7444359.pdf?src-supplier=Digi-Key; ComponentLink2URL: https://datasheet.ciiva.com/7444/littelfuse-fuse-466-7444363.pdf?src-supplier=Digi-Key; ComponentLink2Description: https://datasheet.ciiva.com/7444/littelfuse-fuse-466-7444363.pdf?src-supplier=Digi-Key; ComponentLink3URL: https://datasheet.ciiva.com/7444/littelfuse-fuse-466-7444350.pdf?src-supplier=Digi-Key; ComponentLink3Description: https://datasheet.ciiva.com/7444/littelfuse-fuse-466-7444350.pdf?src-supplier=Digi-Key; Supplier Part Number 1: F1452CT-ND; Supplier 2: Digi-Key; Manufacturer 2: Littelfuse; Manufacturer Part Number 2: 0324015.HXP; Stock 2: 64; Pricing 2: 1=1.74000, 5=1.65600, 10=1.57300, 50=1.26960, 100=1.07640, 250=1.04880, 500=0.88320, 1000=0.78660, 5000=0.69000 (USD); Termination: Axial; Diameter: 6.985mm; REACH SVHC: Unknown; Lead Free: Lead Free; ComponentLink4URL: https://datasheet.ciiva.com/7880/314p-324p-7880741.pdf?src-supplier=Element14; ComponentLink4Description: https://datasheet.ciiva.com/7880/314p-324p-7880741.pdf?src-supplier=Element14; ComponentLink5URL: https://datasheet.ciiva.com/16369/314-324-16369693.pdf?src-supplier=Future+Electronics; ComponentLink5Description: https://datasheet.ciiva.com/16369/314-324-16369693.pdf?src-supplier=Future+Electronics; ComponentLink6URL: https://datasheet.ciiva.com/302/littelfuse-fuse-314-324-302287.pdf?src-supplier=Digi-Key; ComponentLink6Description: https://datasheet.ciiva.com/302/littelfuse-fuse-314-324-302287.pdf?src-supplier=Digi-Key; Supplier Part Number 2: F1870-ND
F6 = FUSE_2A_1206: FUSE SMD 2A 63V; Manufacturer 1: Littelfuse; Manufacturer Part Number 1: 0466002.NRHF; Fuse Type: Board Mount (Cartridge Style Excluded); DC Cold Resistance: 31mR; Power Dissipation: 157.5mW; Approvals: UL,CSA; Supplier 1: Digi-Key; Stock 1: 8989; Pricing 1: 1=0.84000, 5=0.81200, 10=0.78700, 50=0.66180, 100=0.54930, 250=0.49940, 500=0.42450, 1000=0.37455 (USD); RoHS: Yes; Mount: Surface Mount; Case/Package: 1206; Case Code (Imperial): 1206; Case Code (Metric): 3216; Housing Material: Ceramic; Min Operating Temperature: -55°C; Max Operating Temperature: 90°C; Package Quantity: 5000; Voltage Rating (AC): 63V; Voltage Rating (DC): 63V; Packaging: Tape and Reel; Current: 2A; Length: 3.18mm; Height: 0.023inch; Width: 0.06inch; Depth: 1.52mm; ComponentLink1URL: https://datasheet.ciiva.com/7444/littelfuse-fuse-466-7444359.pdf?src-supplier=Digi-Key; ComponentLink1Description: https://datasheet.ciiva.com/7444/littelfuse-fuse-466-7444359.pdf?src-supplier=Digi-Key; ComponentLink2URL: https://datasheet.ciiva.com/7444/littelfuse-fuse-466-7444363.pdf?src-supplier=Digi-Key; ComponentLink2Description: https://datasheet.ciiva.com/7444/littelfuse-fuse-466-7444363.pdf?src-supplier=Digi-Key; ComponentLink3URL: https://datasheet.ciiva.com/7444/littelfuse-fuse-466-7444350.pdf?src-supplier=Digi-Key; ComponentLink3Description: https://datasheet.ciiva.com/7444/littelfuse-fuse-466-7444350.pdf?src-supplier=Digi-Key; Supplier Part Number 1: F5696CT-ND
J1 = HEADER 4X2: CONN HEADER VERT 8POS 2.54MM; Manufacturer 1: Harwin Inc.; Supplier Part Number 1: 952-2122-ND; Supplier 1: Digi-Key; Mount: Through Hole
J3 J6 J7 = CON_6M_SM_RA: CONN HEADER SMD RIGHT ANGLE 2MM PITCH; Manufacturer 1: Molex; Insulation Resistance: 1GR; Current Rating: 3A; Voltage Rating: 250V; Connector Type: Receptacle,Forked; Number of Positions: 6; Gender: Receptacle; Glow Wire Compliant: Non-compliant; Supplier 1: Digi-Key; Stock 1: 7093; Pricing 1: 1=0.81000, 10=0.70800, 25=0.66680, 50=0.63880, 100=0.61110, 250=0.55552 (USD); RoHS: Yes; Mount: Surface Mount; Material: Polybutylene; Color: Natural; Housing Material: PBT; Housing Color: Natural; Contact Plating: Tin; Contact Material: Copper Alloy; Min Operating Temperature: -25°C; Max Operating Temperature: 85°C; Package Quantity: 950; Number of Rows: 1; Fastening Type: Latch; Packaging: Tape and Reel; Termination: Solder; Number of Contacts: 6; Orientation: Right Angle; Number of Circuits: 6; Contact Gender: Female; Max Voltage Rating (AC): 250V; Max Voltage Rating (DC): 250V; Length: 16mm; Pitch: 2mm; Depth: 6.85mm; Radiation Hardening: No; REACH SVHC: Unknown; Flammability Rating: UL94 V-0; ComponentLink1URL: https://datasheet.ciiva.com/755/5024940670-sd-755844.pdf?src-supplier=Digi-Key; ComponentLink1Description: https://datasheet.ciiva.com/755/5024940670-sd-755844.pdf?src-supplier=Digi-Key; ComponentLink2URL: https://datasheet.ciiva.com/24467/101355024940670-pcb-receptacles-24467588.pdf?src-supplier=Onlinecomponents.com; ComponentLink2Description: https://datasheet.ciiva.com/24467/101355024940670-pcb-receptacles-24467588.pdf?src-supplier=Onlinecomponents.com; ComponentLink3URL: https://datasheet.ciiva.com/16656/5024940670-pcb-receptacles-16656439.pdf?src-supplier=Avnet+Europe; ComponentLink3Description: https://datasheet.ciiva.com/16656/5024940670-pcb-receptacles-16656439.pdf?src-supplier=Avnet+Europe; ComponentLink4URL: https://datasheet.ciiva.com/7436/1630854-7436283.pdf?src-supplier=Newark; ComponentLink4Description: https://datasheet.ciiva.com/7436/1630854-7436283.pdf?src-supplier=Newark; ComponentLink5URL: https://datasheet.ciiva.com/5157/5024940670-pcb-receptacles-179322-5157180.pdf?src-supplier=Mouser; ComponentLink5Description: https://datasheet.ciiva.com/5157/5024940670-pcb-receptacles-179322-5157180.pdf?src-supplier=Mouser; ComponentLink6URL: https://datasheet.ciiva.com/7917/1630854-7917014.pdf?src-supplier=Element14; ComponentLink6Description: https://datasheet.ciiva.com/7917/1630854-7917014.pdf?src-supplier=Element14; ComponentLink7URL: https://datasheet.ciiva.com/30242/101355024940670-pcb-receptacles-30242550.pdf?src-supplier=Onlinecomponents.com; ComponentLink7Description: https://datasheet.ciiva.com/30242/101355024940670-pcb-receptacles-30242550.pdf?src-supplier=Onlinecomponents.com; ComponentLink8URL: https://datasheet.ciiva.com/755/5024940670-sd-755789.pdf?src-supplier=Digi-Key; ComponentLink8Description: https://datasheet.ciiva.com/755/5024940670-sd-755789.pdf?src-supplier=Digi-Key; Supplier Part Number 1: WM2283CT-ND
J4 = CON_12x2M_SM_RA: CONN HEADER SMD RIGHT ANGLE 1.5MM PITCH; Manufacturer 1: Molex; Number of Positions: 24; Gender: Receptacle; Voltage Rating: 100V; Current Rating: 2A; Connector Type: Receptacle,Forked; Glow Wire Compliant: Non-compliant; Supplier 1: Digi-Key; Stock 1: 0; RoHS: Yes; Mount: Surface Mount; Housing Material: Resin; Color: Beige; Contact Plating: Tin; Contact Material: Copper,Tin; Number of Rows: 2; Termination: Solder; Number of Contacts: 24; Package Quantity: 550; Orientation: Right Angle; Fastening Type: Latch; Packaging: Tape and Reel; Contact Gender: Female; Number of Circuits: 24; Pitch: 1.5mm; Radiation Hardening: No; REACH SVHC: Unknown; ComponentLink1URL: https://datasheet.ciiva.com/756/5031481090-sd-756828.pdf?src-supplier=Digi-Key; ComponentLink1Description: https://datasheet.ciiva.com/756/5031481090-sd-756828.pdf?src-supplier=Digi-Key; ComponentLink2URL: https://datasheet.ciiva.com/9468/5031482490-pcb-receptacles-9468097.pdf?src-supplier=Avnet; ComponentLink2Description: https://datasheet.ciiva.com/9468/5031482490-pcb-receptacles-9468097.pdf?src-supplier=Avnet; ComponentLink3URL: https://datasheet.ciiva.com/5163/5031482490-pcb-receptacles-179309-5163128.pdf?src-supplier=Mouser; ComponentLink3Description: https://datasheet.ciiva.com/5163/5031482490-pcb-receptacles-179309-5163128.pdf?src-supplier=Mouser; ComponentLink4URL: https://datasheet.ciiva.com/30219/149215031482490-pcb-receptacles-30219604.pdf?src-supplier=Onlinecomponents.com; ComponentLink4Description: https://datasheet.ciiva.com/30219/149215031482490-pcb-receptacles-30219604.pdf?src-supplier=Onlinecomponents.com; Supplier Part Number 1: WM20820CT-ND
J5 = CON_5M_SM_RA: CONN HEADER SMD RIGHT ANGLE 1.5MM PITCH; Manufacturer 1: Molex; Connector Type: Receptacle,Center Strip Contact; Number of Positions: 5; Current Rating: 2A; Supplier 1: Digi-Key; Stock 1: 2875; RoHS: Yes; Mount: Surface Mount; Termination: Solder; Number of Contacts: 5; Orientation: Right Angle; Number of Circuits: 5; Number of Rows: 1; Supplier Part Number 1: WM14469CT-ND
R5 = RES_470R_0603: RES SMD 470 OHM 1% 1/10W 0603; Manufacturer: Yageo; MPN: AC0603FR-07470RL; Package: 0603 (1608 Metric); Dimensions: 0.063" L x 0.031" W (1.60mm x 0.80mm); Tolerance: 1%; Supplier Part Number 1: 311-470LDCT-ND; Supplier 1: Digi-Key
R7 = RES_10K_0603: as R3 on sheet MCU; Package: 0603 (1608 Metric); Dimensions: 0.063" L x 0.031" W (1.60mm x 0.80mm); Tolerance: 5%; Supplier Part Number 1: 311-10KGRCT-ND; Supplier 1: Digi-Key

## Sheet CAN.SchDoc: Gimbal - CAN
size Letter; Author: Jing Hao Yao; DrawnBy: Aidan Gratton & Jing Hao Yao; Organization: UW Robotics; Address1: 200 University Avenue; Address2: Waterloo; Address3: Ontario; Address4: Canada N2L 3G6; SheetNumber: 5; SheetTotal: 7
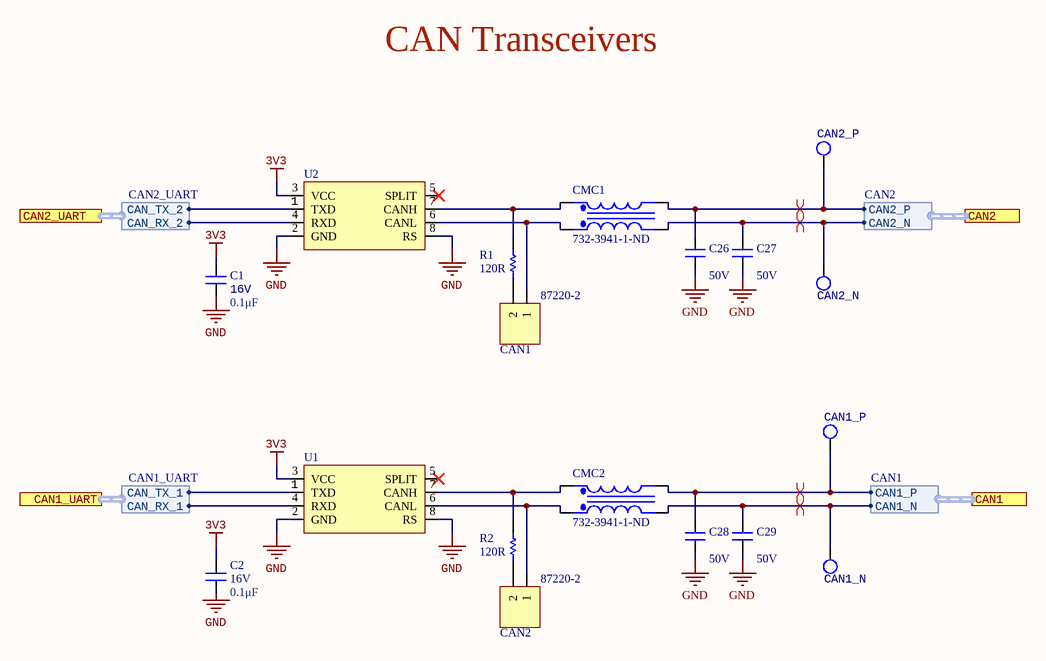
[diagram p3: CAN.SchDoc]

### Parts
C1  value 0.1μF  Voltage Rating: 16V  [CAPC0603(1608)55_N]  (hidden comment: CAP_0.1uF_16V_0603)
C2  value 0.1μF  Voltage Rating: 16V  [CAPC0603(1608)55_N]  (hidden comment: CAP_0.1uF_16V_0603)
C26  Voltage: 50V  [CAPC0603(1608)55_N]  (hidden comment: CAP_33pF_50V_0603)
C27  Voltage: 50V  [CAPC0603(1608)55_N]  (hidden comment: CAP_33pF_50V_0603)
C28  Voltage Rating: 50V  [CAPC0603(1608)55_N]  (hidden comment: CAP_33pF_50V_0603)
C29  Voltage Rating: 50V  [CAPC0603(1608)55_N]  (hidden comment: CAP_33pF_50V_0603)
CAN1  Manufacturer Part Number 1: 87220-2  [HDR1X2]  (hidden comment: JUMPER_2)
CAN1_N  TESTPOINT_LOOP  [TESTPOINT_LOOP]  (value not drawn)
CAN1_P  TESTPOINT_LOOP  [TESTPOINT_LOOP]  (value not drawn)
CAN2  Manufacturer Part Number 1: 87220-2  [HDR1X2]  (hidden comment: JUMPER_2)
CAN2_N  TESTPOINT_LOOP  [TESTPOINT_LOOP]  (value not drawn)
CAN2_P  TESTPOINT_LOOP  [TESTPOINT_LOOP]  (value not drawn)
CMC1  Supplier Part Number 1: 732-3941-1-ND  [744212510]  (hidden comment: CMC_51uH)
CMC2  Supplier Part Number 1: 732-3941-1-ND  [744212510]  (hidden comment: CMC_51uH)
R1  value 120R  [RESC0603(1608)_N]  (hidden comment: RES_120R_0603)
R2  value 120R  [RESC0603(1608)_N]  (hidden comment: RES_120R_0603)
U1  IC TXRX CAN  [LT-S8_N]  (value not drawn)
U2  IC TXRX CAN  [LT-S8_N]  (value not drawn)

### Ports
CAN1 (harness CAN1), CAN1_UART (harness CAN1_UART), CAN2 (harness CAN2), CAN2_UART (harness CAN2_UART)

### Harnesses
CAN1: CAN1_P, CAN1_N
CAN2: CAN2_P, CAN2_N
CAN2_UART: CAN_RX_2, CAN_TX_2
CAN1_UART: CAN_RX_1, CAN_TX_1

### Nets
3V3: C1.2 C2.2 U1.3(VCC) U2.3(VCC)
GND: C1.1 C2.1 C26.1 C27.1 C28.1 C29.1 U1.2(GND) U1.8(RS) U2.2(GND) U2.8(RS)
CAN1_A_N: C29.2 CAN1_N.1 CMC2.5(Pri-) ; port CAN1.CAN1_N
CAN1_A_P: C28.2 CAN1_P.1 CMC2.4(Sec-) ; port CAN1.CAN1_P
CAN2_A_N: C27.2 CAN2_N.1 CMC1.5(Pri-) ; port CAN2.CAN2_N
CAN2_A_P: C26.2 CAN2_P.1 CMC1.4(Sec-) ; port CAN2.CAN2_P
NetCAN1_1: CAN1.1 CMC1.1(Pri+) U2.6(CANL)
NetCAN1_2: CAN1.2 R1.2
NetCAN2_1: CAN2.1 CMC2.1(Pri+) U1.6(CANL)
NetCAN2_2: CAN2.2 R2.2
NetCMC1_3: CMC1.3(Sec+) R1.1 U2.7(CANH)
NetCMC2_3: CMC2.3(Sec+) R2.1 U1.7(CANH)
NetU1_1: U1.1(TXD) ; port CAN1_UART.CAN_TX_1
NetU1_4: U1.4(RXD) ; port CAN1_UART.CAN_RX_1
NetU2_1: U2.1(TXD) ; port CAN2_UART.CAN_TX_2
NetU2_4: U2.4(RXD) ; port CAN2_UART.CAN_RX_2

Not connected (* = marked no-connect by the designer): U1 5(SPLIT)*; U2 5(SPLIT)*

### Layout directives
differential pair: CAN1_A_N, CAN1_A_P, CAN2_A_N, CAN2_A_P

### Notes on the sheet
- CAN Transceivers
- Title
- Size:
- Date:
- Letter
- Drawn By:
- Sheet
- of
- File:

### Library data of the parts
C1 C2 = CAP_0.1uF_16V_0603: as C8 on sheet MCU; Dimensions: 0.063" L x 0.031" W (1.60mm x 0.80mm); Package: 0603 (1608 Metric); Temperature Coefficient: X7R; Supplier Part Number 1: 311-1088-1-ND; Supplier 1: Digi-Key; Mount: Surface Mount; Case Code (Imperial): 0603; Case Code (Metric): 1608; Dielectric: X7R
C26-C29 = CAP_33pF_50V_0603: CAP CER 33PF 50V C0G/NP0; Manufacturer 1: Yageo; Manufacturer Part Number 1: CC0603JRNPO9BN330; Dielectric Material: Ceramic; Temperature Coefficient: 30ppm/°C; Tolerance: 5%; Dielectric: C0G, NP0; Insulation Resistance: 100GR; Supplier 1: Digi-Key; Stock 1: 177901; Pricing 1: 1=0.10000, 10=0.04900, 100=0.02190, 500=0.01566, 1000=0.01231 (USD); RoHS: Yes; Mount: Surface Mount; Number of Pins: 2; Case Code (Metric): 1608; Case Code (Imperial): 0603; Min Operating Temperature: -55°C; Max Operating Temperature: 125°C; Termination: SMD/SMT; Composition: Ceramic; Packaging: Tape and Reel; Package Quantity: 1; Voltage Rating (DC): 50V; Length: 1.6mm; Height: 0.8mm; Thickness: 0.035inch; Depth: 0.8mm; Width: 0.031inch; Radiation Hardening: No; Lead Free: Lead Free; REACH SVHC: No SVHC; ComponentLink1URL: https://datasheet.ciiva.com/11786/0900766b8079c870-11786082.pdf?src-supplier=RSComponents; ComponentLink1Description: https://datasheet.ciiva.com/11786/0900766b8079c870-11786082.pdf?src-supplier=RSComponents; ComponentLink2URL: https://datasheet.ciiva.com/26862/getdatasheetpartid-403532-26862767.pdf?src-supplier=Verical; ComponentLink2Description: https://datasheet.ciiva.com/26862/getdatasheetpartid-403532-26862767.pdf?src-supplier=Verical; ComponentLink3URL: https://datasheet.ciiva.com/144/mlccorderingcode-144643.pdf?src-supplier=Digi-Key; ComponentLink3Description: https://datasheet.ciiva.com/144/mlccorderingcode-144643.pdf?src-supplier=Digi-Key; ComponentLink4URL: https://datasheet.ciiva.com/144/mlccorderingcode-144645.pdf?src-supplier=Digi-Key; ComponentLink4Description: https://datasheet.ciiva.com/144/mlccorderingcode-144645.pdf?src-supplier=Digi-Key; ComponentLink5URL: https://datasheet.ciiva.com/8033/1372269-8033734.pdf?src-supplier=Element14; ComponentLink5Description: https://datasheet.ciiva.com/8033/1372269-8033734.pdf?src-supplier=Element14; ComponentLink6URL: https://datasheet.ciiva.com/8033/1443161-8033735.pdf?src-supplier=Element14; ComponentLink6Description: https://datasheet.ciiva.com/8033/1443161-8033735.pdf?src-supplier=Element14; ComponentLink7URL: https://datasheet.ciiva.com/11464/upy-gp-np0-16v-to-50v-8-11464730.pdf?src-supplier=Avnet; ComponentLink7Description: https://datasheet.ciiva.com/11464/upy-gp-np0-16v-to-50v-8-11464730.pdf?src-supplier=Avnet; ComponentLink8URL: https://datasheet.ciiva.com/46430/1835847-46430155.pdf?src-supplier=Element14; ComponentLink8Description: https://datasheet.ciiva.com/46430/1835847-46430155.pdf?src-supplier=Element14; ComponentLink9URL: https://datasheet.ciiva.com/144/mlccorderingcode-144644.pdf?src-supplier=Digi-Key; ComponentLink9Description: https://datasheet.ciiva.com/144/mlccorderingcode-144644.pdf?src-supplier=Digi-Key; ComponentLink10URL: https://datasheet.ciiva.com/5426/upy-gp-np0-16v-to-50v-8-5426614.pdf?src-supplier=Mouser; ComponentLink10Description: https://datasheet.ciiva.com/5426/upy-gp-np0-16v-to-50v-8-5426614.pdf?src-supplier=Mouser; ComponentLink11URL: https://datasheet.ciiva.com/7978/1443161-7978142.pdf?src-supplier=Element14; ComponentLink11Description: https://datasheet.ciiva.com/7978/1443161-7978142.pdf?src-supplier=Element14; Supplier Part Number 1: 311-1064-1-ND; Value: 33pF; Package: 0603 (1608 Metric)
  C26 C27: Voltage Rating: 50V
  C28 C29: Voltage: 50V
CAN1 CAN2 = JUMPER_2: HEADER 2X1; Manufacturer 1: TE Connectivity; Supplier 1: Digi-Key; Supplier Part Number 1: A26542-ND; Mount: Through Hole
CAN1_N CAN1_P CAN2_N CAN2_P = TESTPOINT_LOOP: as GND_2 on sheet MCU; Supplier Part Number 1: 36-5002-ND; Supplier 1: Digi-Key; Mount: Through Hole
CMC1 CMC2 = CMC_51uH: CMC 51uH 300MA 2LN SMD; Manufacturer 1: Wurth Electronics; Core Material: Ferrite; DC Resistance (DCR): 160mR; Test Frequency: 100kHz; Inductance Tolerance: 50%; Voltage Rating (DC): 80V; Number of Lines: 2; Impedance: 300R; Supplier 1: Digi-Key; Manufacturer Part Number 1: 744212510; Stock 1: 1070; Pricing 1: 1=4.22000, 10=4.16600, 50=3.76300, 100=3.62900, 500=3.36000 (USD); RoHS: Yes; Mount: Surface Mount; Case/Package: SMD/SMT; Number of Pins: 4; Min Operating Temperature: -40°C; Max Operating Temperature: 105°C; Current: 300mA; Max DC Current: 300mA; Termination: SMD/SMT; Current Rating: 300mA; Inductance: 51uH; Tolerance: 50%; Package Quantity: 1000; Packaging: Tape and Reel; Length: 6.5mm; Height: 1.65mm; Depth: 3.6mm; Width: 0.142inch; REACH SVHC: No SVHC; Lead Free: Lead Free; ComponentLink1URL: https://datasheet.ciiva.com/11800/0900766b8059564e-11800467.pdf?src-supplier=RSComponents; ComponentLink1Description: https://datasheet.ciiva.com/11800/0900766b8059564e-11800467.pdf?src-supplier=RSComponents; ComponentLink2URL: https://datasheet.ciiva.com/1130/744212510-1130407.pdf?src-supplier=Newark; ComponentLink2Description: https://datasheet.ciiva.com/1130/744212510-1130407.pdf?src-supplier=Newark; ComponentLink3URL: https://datasheet.ciiva.com/6048/1735560-6048484.pdf?src-supplier=Farnell; ComponentLink3Description: https://datasheet.ciiva.com/6048/1735560-6048484.pdf?src-supplier=Farnell; ComponentLink4URL: https://datasheet.ciiva.com/4952/744212510-77598-4952687.pdf?src-supplier=Mouser; ComponentLink4Description: https://datasheet.ciiva.com/4952/744212510-77598-4952687.pdf?src-supplier=Mouser; ComponentLink5URL: https://datasheet.ciiva.com/6216/744212510-6216346.pdf?src-supplier=Digi-Key; ComponentLink5Description: https://datasheet.ciiva.com/6216/744212510-6216346.pdf?src-supplier=Digi-Key; ComponentLink6URL: https://datasheet.ciiva.com/22705/1735560-22705131.pdf?src-supplier=Element14; ComponentLink6Description: https://datasheet.ciiva.com/22705/1735560-22705131.pdf?src-supplier=Element14; ComponentLink7URL: https://datasheet.ciiva.com/6216/744212510-6216348.pdf?src-supplier=Digi-Key; ComponentLink7Description: https://datasheet.ciiva.com/6216/744212510-6216348.pdf?src-supplier=Digi-Key; ComponentLink8URL: https://datasheet.ciiva.com/7764/1735560-7764951.pdf?src-supplier=Element14; ComponentLink8Description: https://datasheet.ciiva.com/7764/1735560-7764951.pdf?src-supplier=Element14
R1 R2 = RES_120R_0603: as R6 on sheet MCU; Package: 0603 (1608 Metric); Dimensions: 0.063" L x 0.031" W (1.60mm x 0.80mm); Tolerance: 5%; Supplier Part Number 1: 311-120GRCT-ND; Supplier 1: Digi-Key
U1 U2 = LTC2875: IC TXRX CAN 4MBPS 8SO; Manufacturer 1: Linear Technologies; Manufacturer Part Number 1: LTC2875IS8#PBF; Package: 8-SOIC (0.154", 3.90mm Width); ComponentLink1Description: Datasheet; ComponentLink1URL: https://www.analog.com/media/en/technical-documentation/data-sheets/2875f.pdf; Supplier Part Number 1: LTC2875IS8#PBF-ND; Supplier 1: Digi-Key; Mount: Surface Mount